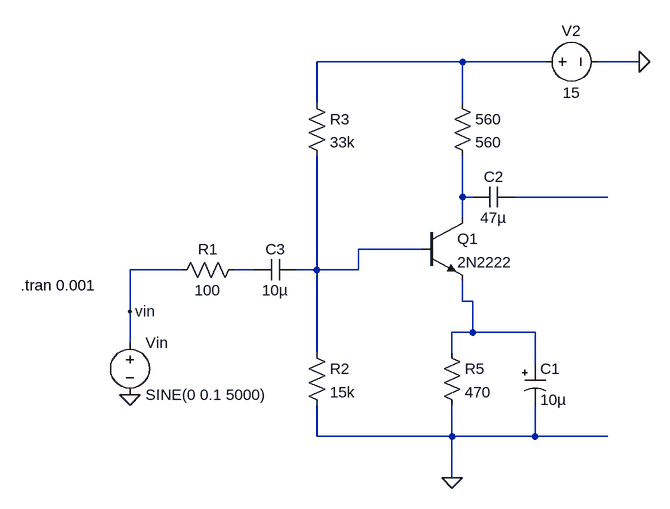
[diagram p0: schematic Step0_circuitCE.asc]
Step0_circuitCE.asc, the LTspice schematic file:
Version 4
SHEET 1 880 680
WIRE 336 -448 112 -448
WIRE 464 -448 336 -448
WIRE 608 -448 544 -448
WIRE 112 -384 112 -448
WIRE 336 -384 336 -448
WIRE 336 -240 336 -304
WIRE 352 -240 336 -240
WIRE 560 -240 416 -240
WIRE 336 -208 336 -240
WIRE 272 -160 176 -160
WIRE -96 -128 -176 -128
WIRE 16 -128 -16 -128
WIRE 112 -128 112 -304
WIRE 112 -128 80 -128
WIRE 176 -128 176 -160
WIRE 176 -128 112 -128
WIRE 336 -80 336 -112
WIRE 352 -80 336 -80
WIRE -176 -64 -176 -128
WIRE 352 -32 352 -80
WIRE 352 -32 320 -32
WIRE 448 -32 352 -32
WIRE -176 -16 -176 -64
WIRE 112 0 112 -128
WIRE 320 0 320 -32
WIRE 448 16 448 -32
WIRE 112 128 112 80
WIRE 320 128 320 80
WIRE 320 128 112 128
WIRE 448 128 448 80
WIRE 448 128 320 128
WIRE 560 128 448 128
WIRE 320 192 320 128
FLAG 320 192 0
FLAG 608 -448 0
FLAG -176 64 0
FLAG -176 -64 vin
SYMBOL res 0 -144 R90
WINDOW 0 0 56 VBottom 2
WINDOW 3 32 56 VTop 2
SYMATTR InstName R1
SYMATTR Value 100
SYMBOL res 96 -16 R0
SYMATTR InstName R2
SYMATTR Value 15k
SYMBOL res 96 -400 R0
SYMATTR InstName R3
SYMATTR Value 33k
SYMBOL res 320 -400 R0
SYMATTR InstName 560
SYMATTR Value 560
SYMBOL res 304 -16 R0
SYMATTR InstName R5
SYMATTR Value 470
SYMBOL polcap 432 16 R0
WINDOW 3 24 56 Left 2
SYMATTR Value 10µ
SYMATTR InstName C1
SYMATTR Description Capacitor
SYMATTR Type cap
SYMATTR SpiceLine V=6.3 Irms=0 Rser=4 Lser=0 mfg="AVX" pn="TAJA106M006" type="Tantalum"
SYMBOL cap 80 -144 R90
WINDOW 0 0 32 VBottom 2
WINDOW 3 32 32 VTop 2
SYMATTR InstName C3
SYMATTR Value 10µ
SYMATTR SpiceLine V=25 Irms=0 Rser=0.001 Lser=0 mfg="TDK" pn="C575OX7RIE106M" type="X7R"
SYMBOL npn 272 -208 R0
SYMATTR InstName Q1
SYMATTR Value 2N2222
SYMBOL voltage -176 -32 R0
WINDOW 123 0 0 Left 0
WINDOW 39 0 0 Left 0
SYMATTR InstName Vin
SYMATTR Value SINE(0 0.1 5000)
SYMBOL voltage 448 -448 R270
WINDOW 0 32 56 VTop 2
WINDOW 3 -32 56 VBottom 2
SYMATTR InstName V2
SYMATTR Value 15
SYMBOL cap 416 -256 R90
WINDOW 0 0 32 VBottom 2
WINDOW 3 32 32 VTop 2
SYMATTR InstName C2
SYMATTR Value 47µ
SYMATTR SpiceLine V=4 Irms=0 Rser=0 Lser=0 mfg="Murata" pn="GRM188R60G476ME15" type="X5R"
TEXT -344 -104 Left 2 !.tran 0.001

The netlist it stands for:
* Step0_circuitCE.asc
R1 N005 vin 100
R2 N004 0 15k
R3 N001 N004 33k
R§560 N001 N002 560
R5 N006 0 470
C1 N006 0 10µ V=6.3 Irms=0 Rser=4 Lser=0 mfg="AVX" pn="TAJA106M006" type="Tantalum"
C3 N004 N005 10µ V=25 Irms=0 Rser=0.001 Lser=0 mfg="TDK" pn="C575OX7RIE106M" type="X7R"
Q1 N002 N004 N006 0 2N2222
Vin vin 0 SINE(0 0.1 5000)
V2 N001 0 15
C2 N003 N002 47µ V=4 Irms=0 Rser=0 Lser=0 mfg="Murata" pn="GRM188R60G476ME15" type="X5R"
.model NPN NPN
.model PNP PNP
.lib standard.bjt
.tran 0.001
.backanno
.end